# EAGLE design TouchWidget_HowTo (EAGLE 6.4)
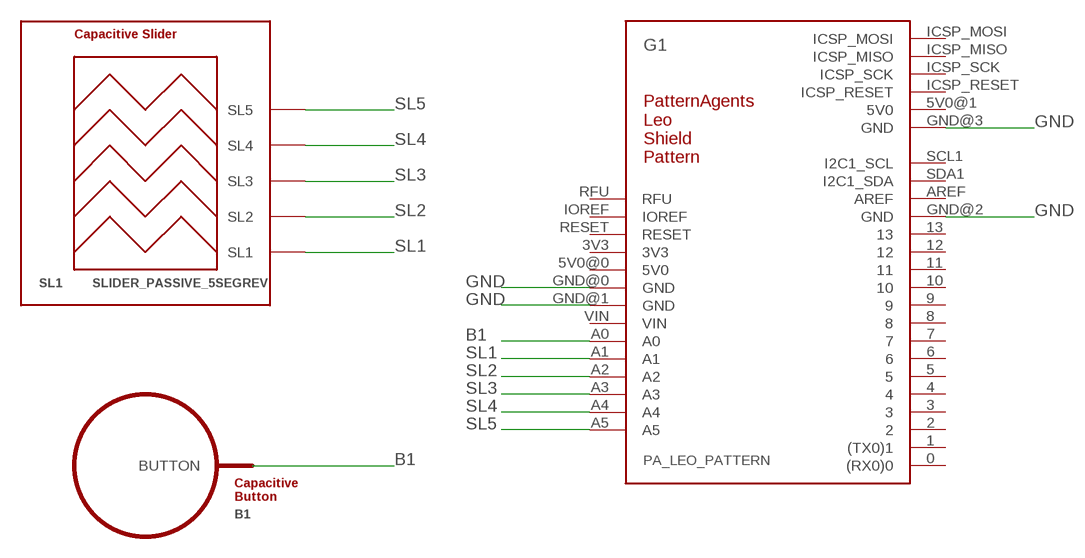
[diagram p0: schematic, sheet 1]

## Parts
B1  BUTTON_PASSIVE10MM  [BUTTON_PASSIVE_10MM]
G1  PA_LEO_PATTERN  [PA_LEO_PATTERN]
SL1  SLIDER_PASSIVE_5SEGREV  [SLIDER_PASSIVE_5SEG_12MM_REV]

## Nets
B1: B1.BUTTON G1.A0
GND: G1.GND@0(GND) G1.GND@1(GND) G1.GND@2(GND) G1.GND@3(GND)
SL1: G1.A1 SL1.SL1
SL2: G1.A2 SL1.SL2
SL3: G1.A3 SL1.SL3
SL4: G1.A4 SL1.SL4
SL5: G1.A5 SL1.SL5
Unconnected: G1.0((RX0)0) G1.1((TX0)1) G1.2 G1.3 G1.3V3 G1.4 G1.5 G1.5V0@0(5V0) G1.6 G1.7 G1.8 G1.9 G1.10 G1.11 G1.12 G1.13 G1.AREF G1.ICSP_MISO G1.ICSP_MOSI G1.ICSP_RESET G1.ICSP_SCK G1.IOREF G1.RESET G1.SCL1(I2C1_SCL) G1.SDA1(I2C1_SDA) G1.VIN

## Power pins joined to a net without a drawn wire
5V0: G1.5V0@1(5V0)
RFU: G1.RFU

## Library data of the parts
B1 = PatternAgents-TouchWidgets:BUTTON_PASSIVE: Button, Passive Capacitive/Touch Sensing Type Source : http://www.PatternAgents.com Github : https://github.com/PatternAgents License : http://creativecommons.org/licenses/by-sa/3.1/ (Creative Commons 3.1) THIS SOFTWARE IS PROVIDED BY THE CONTRIBUTORS "AS IS" AND WITHOUT ANY EXPRESS OR IMPLIED WARRANTIES, INCLUDING, BUT NOT LIMITED TO, THE IMPLIED WARRANTIES OF MERCHANTABILITY AND FITNESS FOR A PARTICULAR PURPOSE ARE DISCLAIMED. IN NO EVENT SHALL THE COPYRIGHT OWNER OR CONTRIBUTORS BE LIABLE FOR ANY DIRECT, INDIRECT, INCIDENTAL, SPECIAL, EXEMPLARY, OR CONSEQUENTIAL DAMAGES (INCLUDING, BUT NOT LIMITED TO, PROCUREMENT OF SUBSTITUTE GOODS OR SERVICES; LOSS OF USE, DATA, OR PROFITS; OR BUSINESS INTERRUPTION) HOWEVER CAUSED AND ON ANY THEORY OF LIABILITY, WHETHER IN CONTRACT, STRICT LIABILITY, OR TORT (INCLUDING NEGLIGENCE OR OTHERWISE) ARISING IN ANY WAY OUT OF THE USE OF THIS SOFTWARE, EVEN IF ADVISED OF THE POSSIBILITY OF SUCH DAMAGE.
G1 = PatternAgents-Boards:PA_LEO_PATTERN: PatternAgents Leo Shield Pattern Source LBR : http://www.patternagents.com Github : https://github.com/patternagents License : http://creativecommons.org/licenses/by-sa/2.5/ (Creative Commons 2.5) THIS SOFTWARE IS PROVIDED BY THE CONTRIBUTORS "AS IS" AND WITHOUT ANY EXPRESS OR IMPLIED WARRANTIES, INCLUDING, BUT NOT LIMITED TO, THE IMPLIED WARRANTIES OF MERCHANTABILITY AND FITNESS FOR A PARTICULAR PURPOSE ARE DISCLAIMED. IN NO EVENT SHALL THE COPYRIGHT OWNER OR CONTRIBUTORS BE LIABLE FOR ANY DIRECT, INDIRECT, INCIDENTAL, SPECIAL, EXEMPLARY, OR CONSEQUENTIAL DAMAGES (INCLUDING, BUT NOT LIMITED TO, PROCUREMENT OF SUBSTITUTE GOODS OR SERVICES; LOSS OF USE, DATA, OR PROFITS; OR BUSINESS INTERRUPTION) HOWEVER CAUSED AND ON ANY THEORY OF LIABILITY, WHETHER IN CONTRACT, STRICT LIABILITY, OR TORT (INCLUDING NEGLIGENCE OR OTHERWISE) ARISING IN ANY WAY OUT OF THE USE OF THIS SOFTWARE, EVEN IF ADVISED OF THE POSSIBILITY OF SUCH DAMAGE.
SL1 = PatternAgents-TouchWidgets:SLIDER_PASSIVE_5SEG: Slider, Passive Touch/Capacitive Sensing Type, Five (5) Segment Source : http://www.PatternAgents.com Github : https://github.com/PatternAgents License : http://creativecommons.org/licenses/by-sa/3.1/ (Creative Commons 3.1) THIS SOFTWARE IS PROVIDED BY THE CONTRIBUTORS "AS IS" AND WITHOUT ANY EXPRESS OR IMPLIED WARRANTIES, INCLUDING, BUT NOT LIMITED TO, THE IMPLIED WARRANTIES OF MERCHANTABILITY AND FITNESS FOR A PARTICULAR PURPOSE ARE DISCLAIMED. IN NO EVENT SHALL THE COPYRIGHT OWNER OR CONTRIBUTORS BE LIABLE FOR ANY DIRECT, INDIRECT, INCIDENTAL, SPECIAL, EXEMPLARY, OR CONSEQUENTIAL DAMAGES (INCLUDING, BUT NOT LIMITED TO, PROCUREMENT OF SUBSTITUTE GOODS OR SERVICES; LOSS OF USE, DATA, OR PROFITS; OR BUSINESS INTERRUPTION) HOWEVER CAUSED AND ON ANY THEORY OF LIABILITY, WHETHER IN CONTRACT, STRICT LIABILITY, OR TORT (INCLUDING NEGLIGENCE OR OTHERWISE) ARISING IN ANY WAY OUT OF THE USE OF THIS SOFTWARE, EVEN IF ADVISED OF THE POSSIBILITY OF SUCH DAMAGE.

## Board
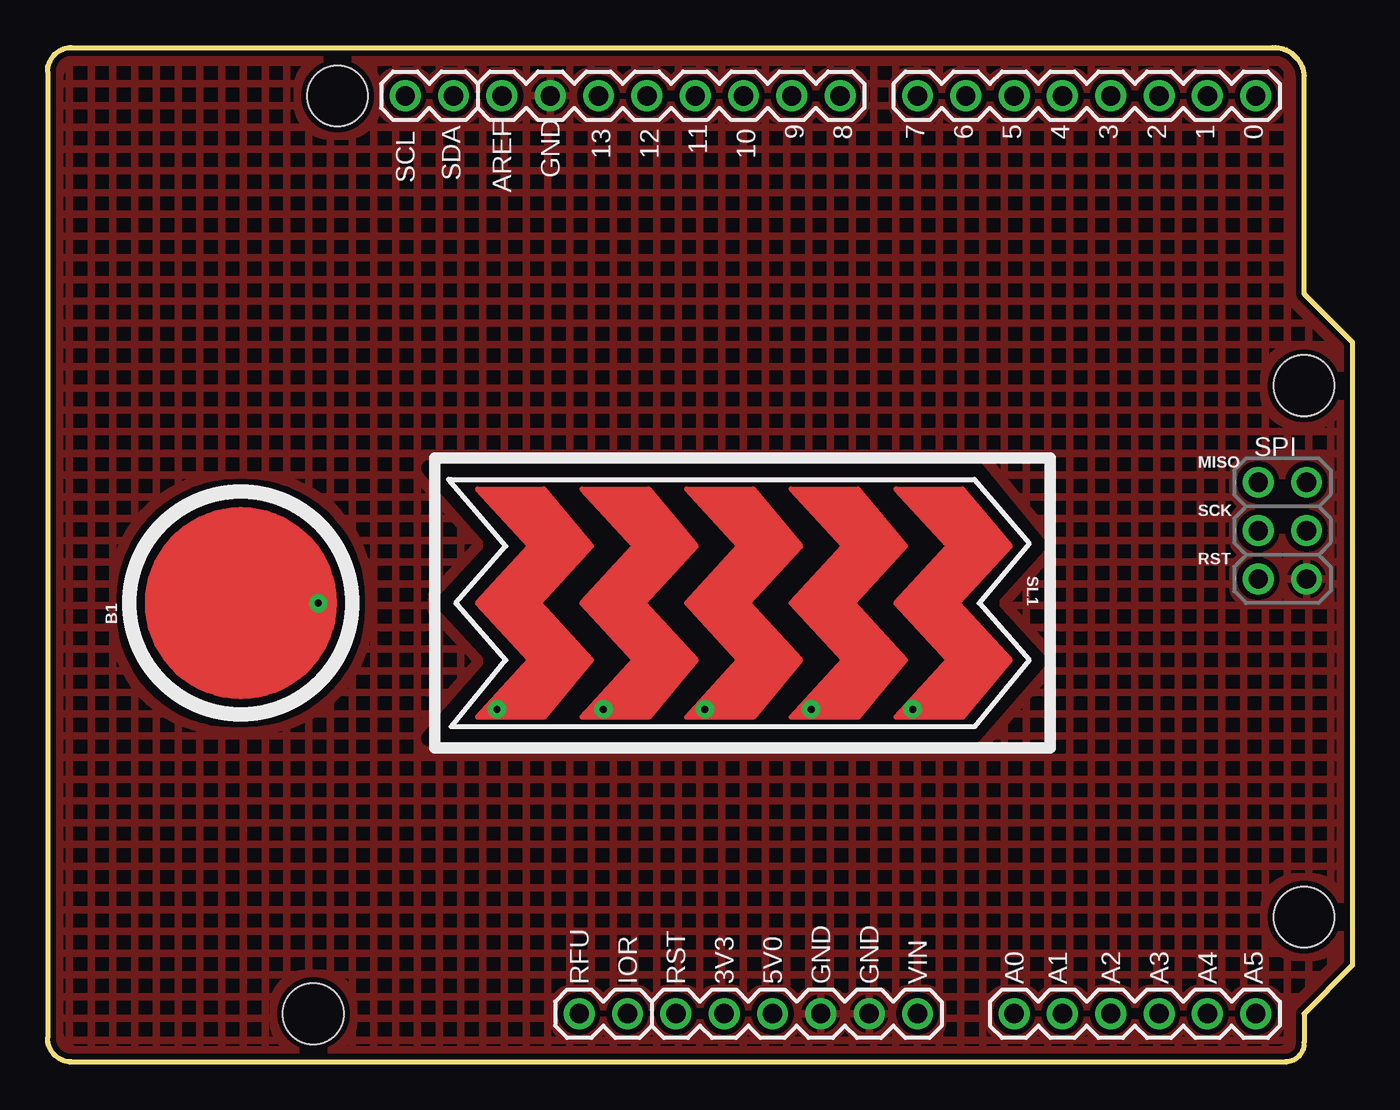
[diagram p1: board, top side]
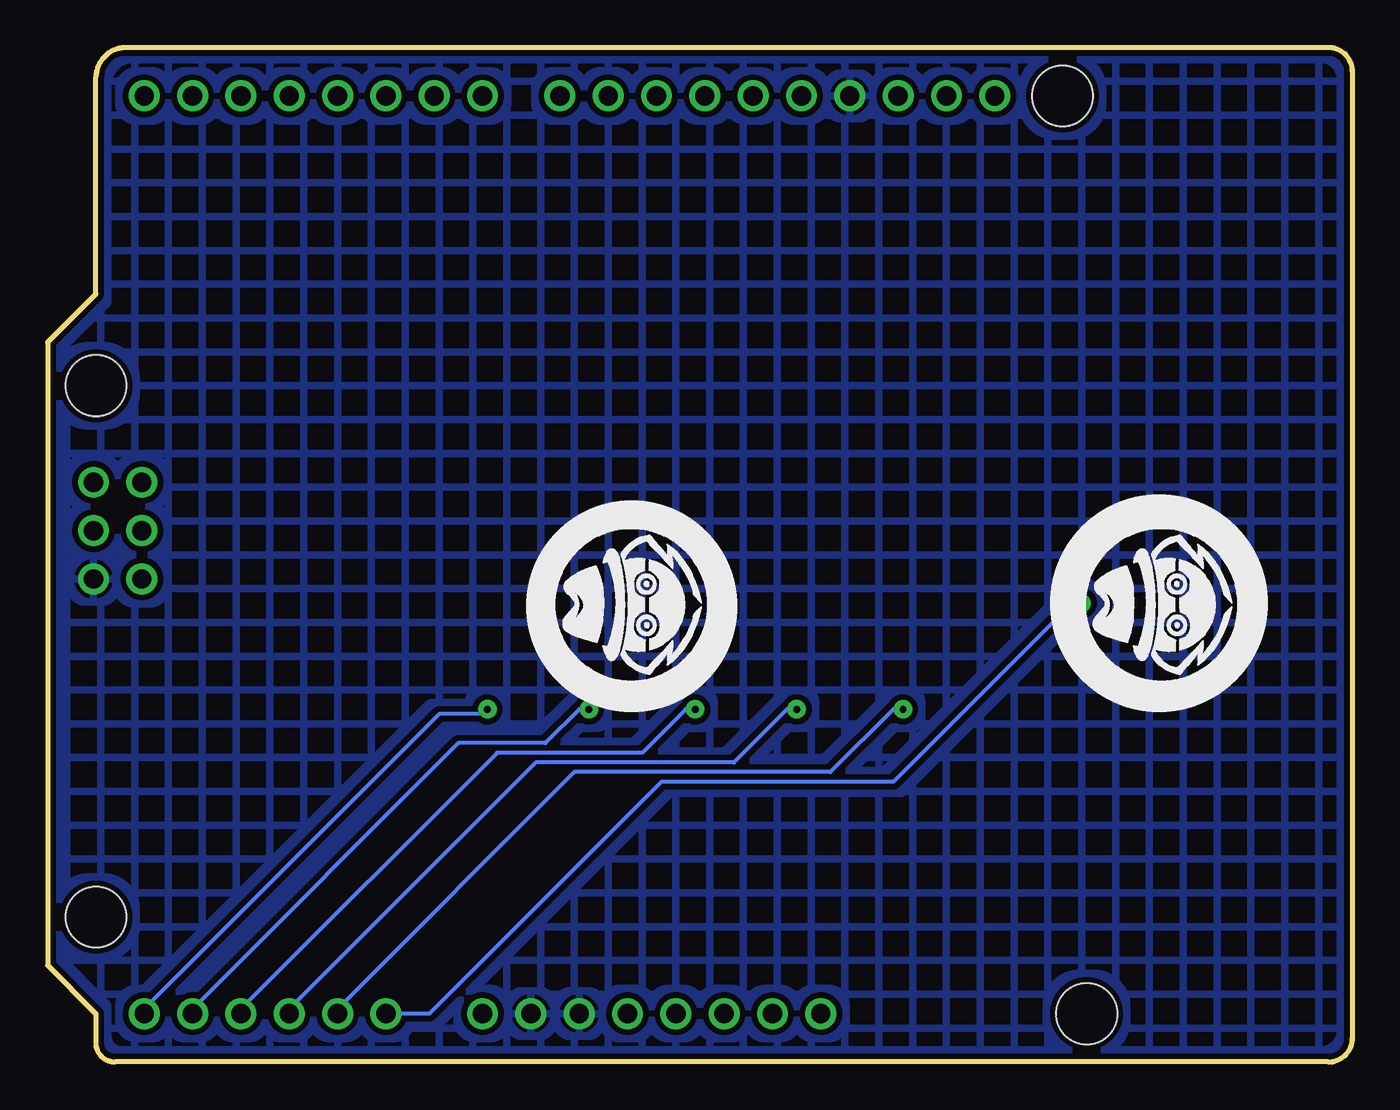
[diagram p2: board, bottom side, seen from below]

Size 68.58 x 53.34 mm. Coordinates in mm from the lower left corner, seen from the top.
Copper layers (1*16): Top 0.035mm / dielectric 1.5mm / Bottom 0.035mm
Design rules "PatternAgents": minimum track width 8mil, minimum drill 14mil, track to track 8mil, track to pad 8mil, pad to pad 8mil, via to via 8mil, smd to smd 8mil, copper to edge 10mil, drill to drill 8mil, minimum pad ring 12mil, minimum via ring 10mil, stop-mask expansion 4mil, vias tented up to drill 25mil, thermal gap 8mil

### Footprints (pad centres in the part's own frame; a part is rotated, then mirrored left to right if it is on the bottom)
BUTTON_PASSIVE_10MM = drill 0.356: BUTTON 0,4.064
PA_LEO_PATTERN = drill 1.016: 0 63.5,50.8; 1 60.96,50.8; 2 58.42,50.8; 3 55.88,50.8; 3V3 35.56,2.54; 4 53.34,50.8; 5 50.8,50.8; 5V0@0 38.1,2.54; 5V0@1 66.167,30.48; 6 48.26,50.8; 7 45.72,50.8; 8 41.656,50.8; 9 39.116,50.8; 10 36.576,50.8; 11 34.036,50.8; 12 31.496,50.8; 13 28.956,50.8; A0 50.8,2.54; A1 53.34,2.54; A2 55.88,2.54; A3 58.42,2.54; A4 60.96,2.54; A5 63.5,2.54; AREF 23.876,50.8; GND@0 40.64,2.54; GND@1 43.18,2.54; GND@2 26.416,50.8; GND@3 66.167,25.4; ICSP_MISO 63.627,30.48; ICSP_MOSI 66.167,27.94; ICSP_RESET 63.627,25.4; ICSP_SCK 63.627,27.94; IOREF 30.48,2.54; RESET 33.02,2.54; RFU 27.94,2.54; SCL1 18.796,50.8; SDA1 21.336,50.8; VIN 45.72,2.54 | hole 3.2: 15.24,50.8; 13.97,2.54; 66.04,35.56; 66.04,7.62
SLIDER_PASSIVE_5SEG_12MM_REV = drill 0.356: SL1 5.588,-13.208; SL2 5.588,-7.62; SL3 5.588,-2.286; SL4 5.588,3.302; SL5 5.588,8.636

### Placement (x,y rotation side)
B1  10.16,24.13 270 top
G1  0,0 0 top
SL1  36.83,24.13 270 top

### Tracks (layer width: path | path; a pad name or v marks a point on that pad's centre or on a via)
B1
  Bottom 0.203: G1.A0 48.51,2.54 36.32,14.73 24.13,14.73 14.73,24.13 B1.BUTTON
GND
  pour Top (isolate 0.305, hatched): 1.02,0 0,1.02 0,52.07 1.02,53.09 1.27,53.34 64.52,53.34 64.77,53.34 66.04,52.07 66.04,40.39 68.58,37.85 68.58,5.08 66.04,2.54 66.04,1.02 65.02,0
  pour Bottom (isolate 0.305, hatched): 1.02,0 0,1.02 0,52.07 1.27,53.34 64.77,53.34 66.04,52.07 66.04,40.39 68.58,37.85 68.58,5.08 66.04,2.54 66.04,1.02 65.02,0
SL1
  Bottom 0.203: G1.A1 53.34,2.79 40.89,15.24 27.43,15.24 24.13,18.54 SL1.SL1
SL2
  Bottom 0.203: G1.A2 55.88,2.79 42.93,15.75 32.51,15.75 29.72,18.54 SL1.SL2
SL3
  Bottom 0.203: G1.A3 58.42,2.79 44.96,16.26 37.34,16.26 35.05,18.54 SL1.SL3
SL4
  Bottom 0.203: G1.A4 60.96,2.79 46.99,16.76 42.42,16.76 40.64,18.54 SL1.SL4
SL5
  Bottom 0.203: G1.A5 63.5,2.79 48.01,18.29 45.72,18.29 SL1.SL5